# EAGLE board BBB_POPS_Cape (EAGLE 6.5.0), part 1 of 2
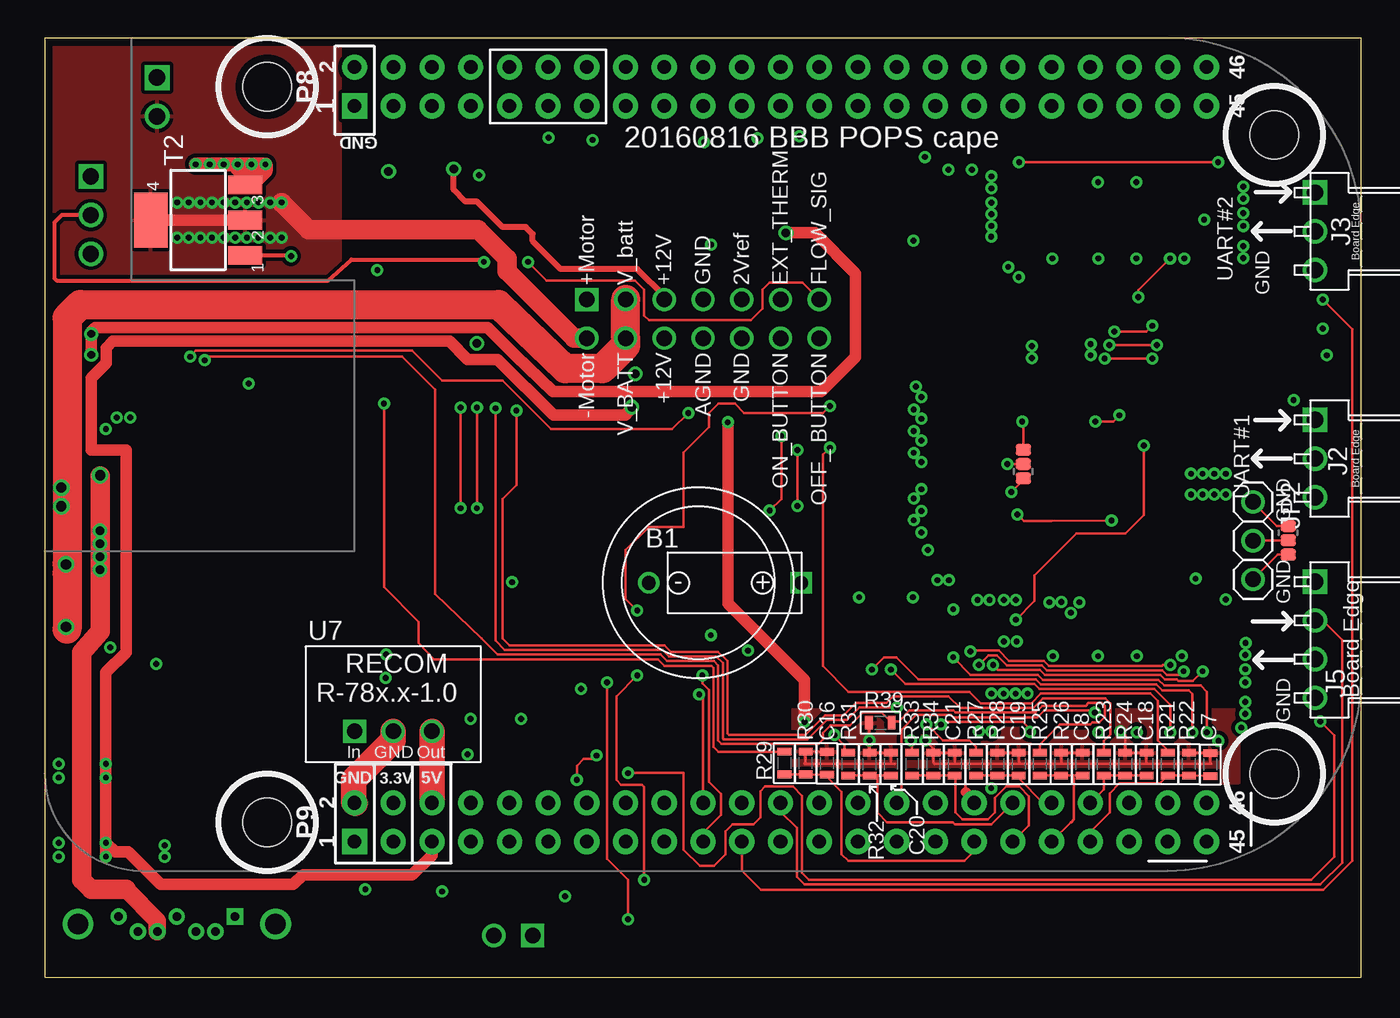
[diagram p5: board, top side]
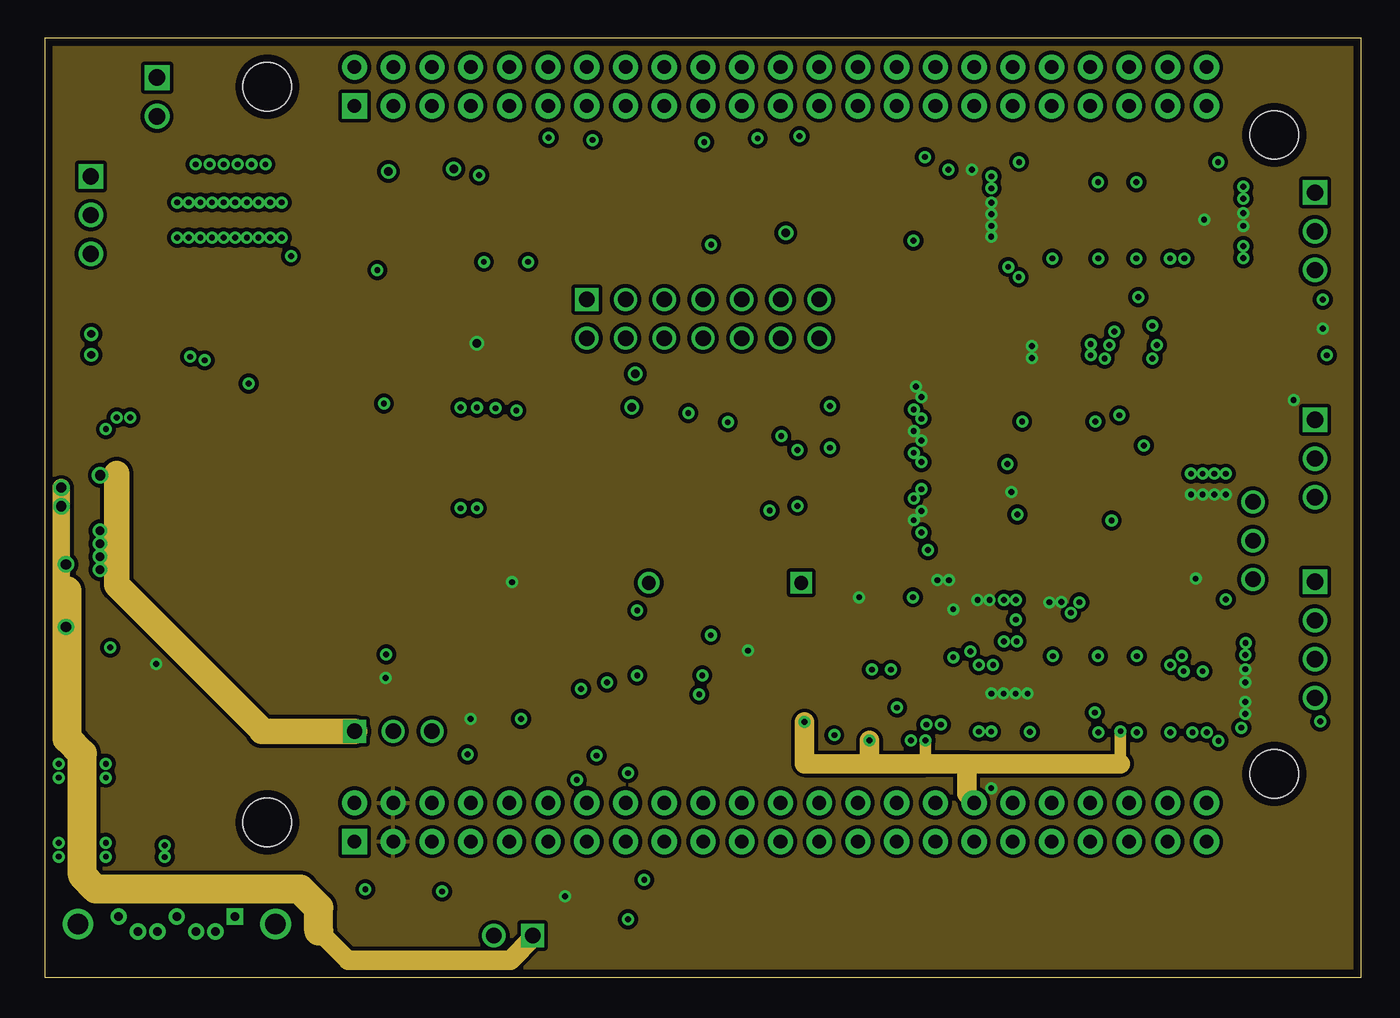
[diagram p6: board, inner layer Route2]
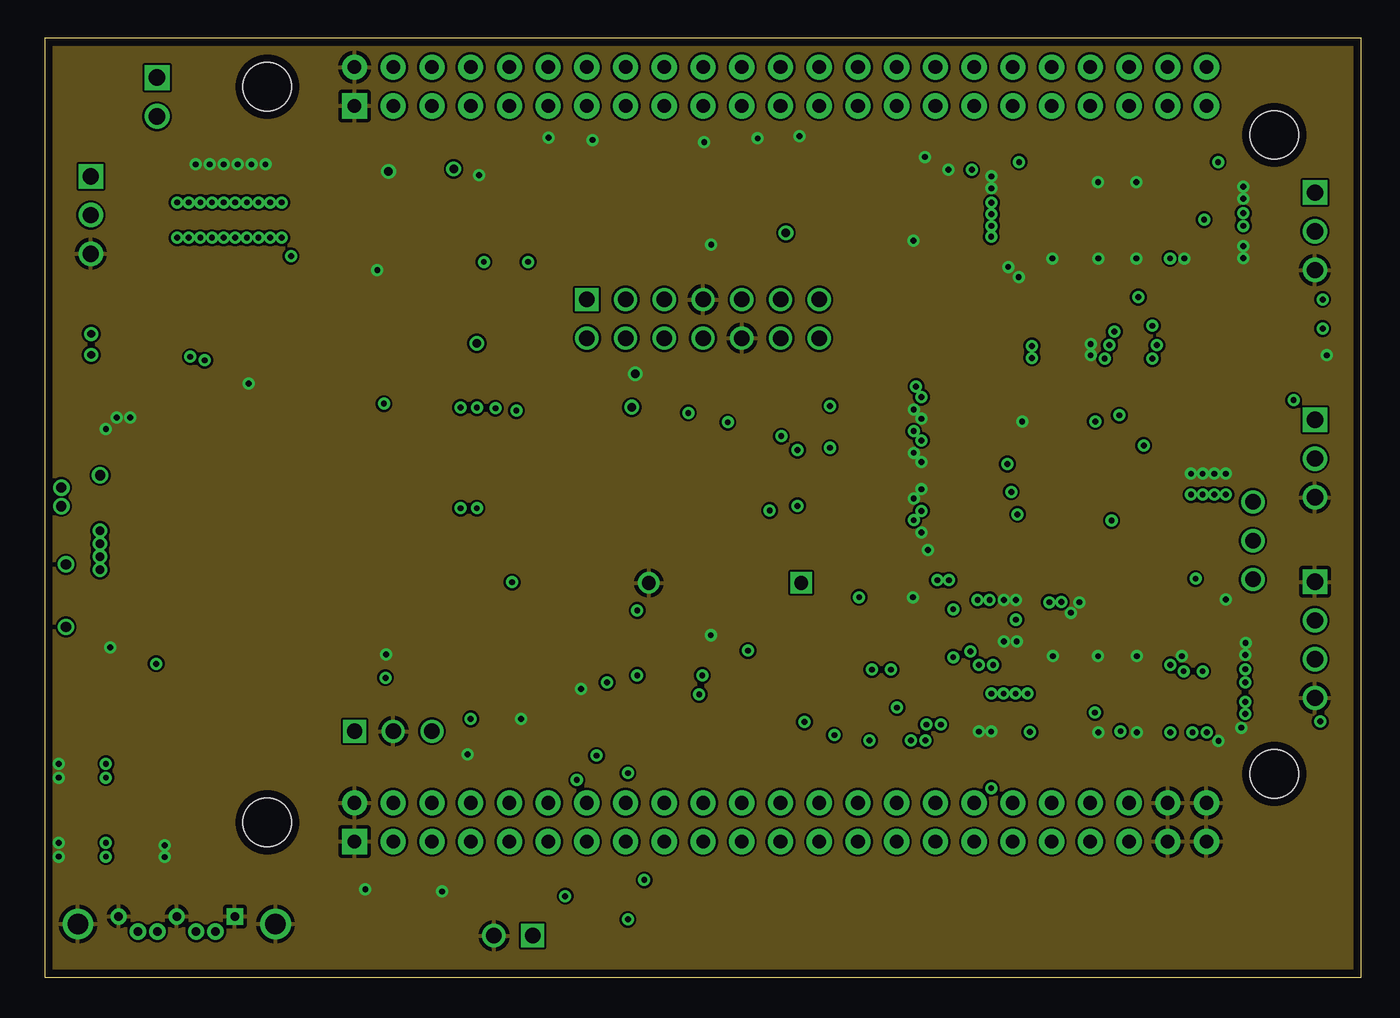
[diagram p7: board, inner layer Route15]
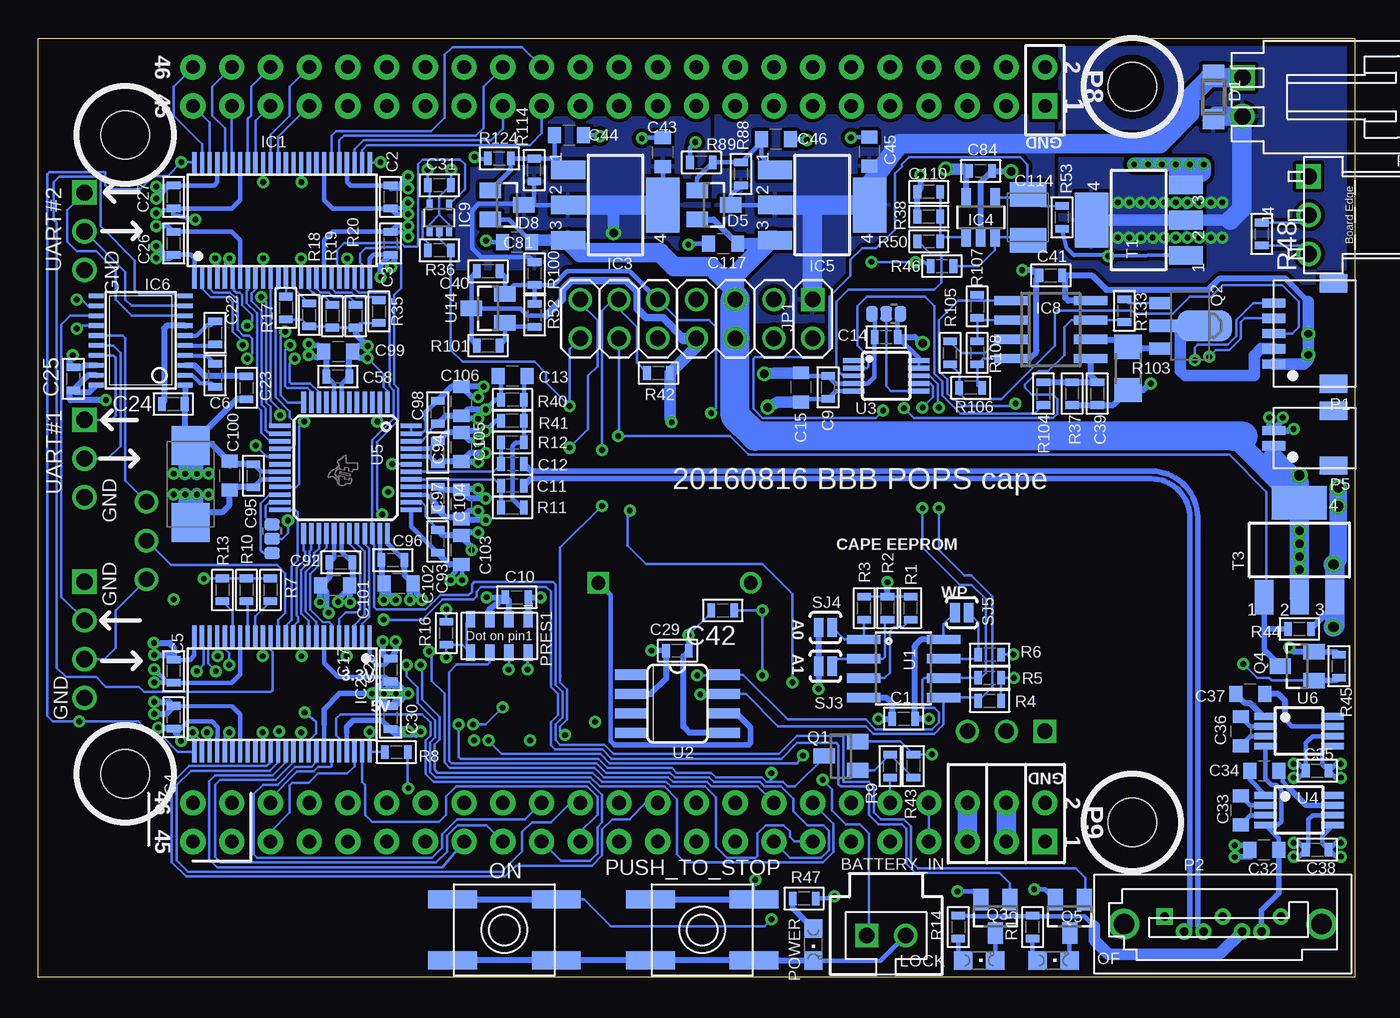
[diagram p8: board, bottom side, seen from below]

Size 86.36 x 61.62 mm. Coordinates in mm from the lower left corner, seen from the top.
Outline: 0,0 86.36,0 86.36,61.62 0,61.62 0,0
Copper layers (1*2+15*16): Top 0.035mm / dielectric 1.5mm / Route2 0.035mm / dielectric 0.15mm / Route15 0.035mm / dielectric 0.2mm / Bottom 0.035mm
Design rules "66each *": minimum track width 6mil, minimum drill 15mil, track to track 6mil, track to pad 6mil, pad to pad 6mil, via to via 6mil, smd to smd 6mil, copper to edge 20mil, drill to drill 10mil, minimum pad ring 10mil, minimum via ring 8mil, stop-mask expansion 4mil, vias tented up to drill 16mil, thermal gap 10mil
Net classes: 0 default: width 0.152 mm, drill 0.381 mm, clearance 0.152 mm; 2 gnd: width 0.152 mm, drill 0.381 mm, clearance 0.152 mm; 3 usbvcc: width 0.152 mm, drill 0.381 mm, clearance 0.152 mm

## Footprints (pad centres in the part's own frame; a part is rotated, then mirrored left to right if it is on the bottom)
BR1225A/HB = drill 0.9 square: P$1 6.75,0 | drill 0.9: P$2 -3.25,0
070543-0036 = drill 1.016 square: P$1 -1.27,0 | drill 1.016: P$2 1.27,0
0603 = smd 0.5 x 0.9: 1 -0.75,0; 2 0.75,0
0805_MARISS = smd 0.846 x 1.059: 1 -0.953,0; 2 0.953,0
C/6032-28R = smd 2.55 x 2.5: + 2.525,0; - -2.525,0
SMC_B = smd 1.6 x 2.4: + -1.5,0; - 1.5,0
DO-219ABVISHAY = smd 1.3 x 1.4: A 1.45,0; C -1.45,0
SOT23 = smd 1 x 1.4: 1 -0.95,-1.1; 2 0.95,-1.1; 3 0,1.1
TSSOP-48 = smd 0.28 x 1.43: 1 -5.49,-3.794; 2 -4.99,-3.794; 3 -4.49,-3.794; 4 -3.99,-3.794; 5 -3.49,-3.794; 6 -2.99,-3.794; 7 -2.49,-3.794; 8 -1.99,-3.794; 9 -1.49,-3.794; 10 -0.99,-3.794; 11 -0.49,-3.794; 12 0.01,-3.794; 13 0.51,-3.794; 14 1.01,-3.794; 15 1.51,-3.794; 16 2.01,-3.794; 17 2.51,-3.794; 18 3.01,-3.794; 19 3.51,-3.794; 20 4.01,-3.794; 21 4.51,-3.794; 22 5.01,-3.794; 23 5.51,-3.794; 24 6.01,-3.794; 25 6.01,3.756; 26 5.51,3.756; 27 5.01,3.756; 28 4.51,3.756; 29 4.01,3.756; 30 3.51,3.756; 31 3.01,3.756; 32 2.51,3.756; 33 2.01,3.756; 34 1.51,3.756; 35 1.01,3.756; 36 0.51,3.756; 37 0.01,3.756; 38 -0.49,3.756; 39 -0.99,3.756; 40 -1.49,3.756; 41 -1.99,3.756; 42 -2.49,3.756; 43 -2.99,3.756; 44 -3.49,3.756; 45 -3.99,3.756; 46 -4.49,3.756; 47 -4.99,3.756; 48 -5.49,3.756
S0T-223 = smd 1.219 x 2.235: 1 -2.311,-3.099; 2 0,-3.099; 3 2.311,-3.099 | smd 3.6 x 2.2: 4 0,3.099
SOT23-5 = smd 0.6 x 1.2: 1 -0.95,-1.306; 2 0,-1.306; 3 0.95,-1.306; 4 0.95,1.306; 5 -0.95,1.306
TSSOP20 = smd 0.305 x 0.991: 1 -2.925,-2.918; 2 -2.275,-2.918; 3 -1.625,-2.918; 4 -0.975,-2.918; 5 -0.325,-2.918; 6 0.325,-2.918; 7 0.975,-2.918; 8 1.625,-2.918; 9 2.275,-2.918; 10 2.925,-2.918; 11 2.925,2.918; 12 2.275,2.918; 13 1.625,2.918; 14 0.975,2.918; 15 0.325,2.918; 16 -0.325,2.918; 17 -0.975,2.918; 18 -1.625,2.918; 19 -2.275,2.918; 20 -2.925,2.918
SO8 = smd 0.6 x 2.2: 1 -1.905,-2.6; 2 -0.635,-2.6; 3 0.635,-2.6; 4 1.905,-2.6; 5 1.905,2.6; 6 0.635,2.6; 7 -0.635,2.6; 8 -1.905,2.6
SC70-5 = smd 0.4 x 0.7: 1 -0.65,-0.85; 2 0,-0.85; 3 0.65,-0.85; 4 0.65,0.85; 5 -0.65,0.85
640457-3 = drill 1.067 square: 1 2.54,0 | drill 1.067: 2 0,0; 3 -2.54,0
640457-4 = drill 1.067 square: 1 3.81,0 | drill 1.067: 2 1.27,0; 3 -1.27,0; 4 -3.81,0
MY_C0R-JMP = smd 0.991 x 0.762: 1 0,0.938; 2 0,0; 3 0,-0.938
2X07_ROUND = drill 1.016 square: 1 -7.62,-1.27 | drill 1.016: 2 -7.62,1.27; 3 -5.08,-1.27; 4 -5.08,1.27; 5 -2.54,-1.27; 6 -2.54,1.27; 7 0,-1.27; 8 0,1.27; 9 2.54,-1.27; 10 2.54,1.27; 11 5.08,-1.27; 12 5.08,1.27; 13 7.62,-1.27; 14 7.62,1.27
1X03_ROUND = drill 1.016: 1 -2.54,0; 2 0,0; 3 2.54,0
LED-805 = smd 1.2 x 1.2: A 0,-1.05; C 0,1.05
EVQ-Q2 = smd 3.2 x 1.2: A -3.4,-2; A' 3.4,-2; B -3.4,2; B' 3.4,2
501568-0509 = smd 0.6 x 1.5: 1 -2,2.54; 2 -1,2.54; 3 0,2.54; 4 1,2.54; 5 2,2.54 | smd 1.2 x 1.8: P$1 3.3,-1.36; P$2 -3.3,-1.36
0471554001 = drill 0.559 pad 1.067 square: 1 3.81,-0.5 | drill 0.559 pad 1.067: 2 2.54,0.5; 3 1.27,0.5; 4 0,-0.5; 5 -1.27,0.5; 6 -2.54,0.5; 7 -3.81,-0.5 | drill 1.35: MH1 -6.48,0; MH2 6.48,0
501568-0207_2-PIN = smd 0.6 x 1.5: 1 -0.5,2.54; 2 0.5,2.54 | smd 1.2 x 1.8: P$1 1.8,-1.36; P$2 -1.8,-1.36
0705530001_2-PIN_H_CGRID_SL = drill 1.092 square: P$1 1.27,0 | drill 1.092: P$2 -1.27,0
MS5607-02BA = smd 1.1 x 0.6: 1 -1.1,1.875; 2 -1.1,0.625; 3 -1.1,-0.625; 4 -1.1,-1.875; 5 1.1,-1.875; 6 1.1,-0.625; 7 1.1,0.625; 8 1.1,1.875
SOT89 = smd 0.8 x 1.4: 1 -1.499,-1.981; 3 1.499,-1.981 | smd 0.8 x 1.9: 2 0,-1.727 | smd 2.032 x 3.65: 2@1 0,0.94
SOT-23 = smd 1 x 1.4: 1 -0.95,-1.1; 2 0.95,-1.1; 3 0,1.1
R1206 = smd 1.6 x 1.803: 1 -1.422,0; 2 1.422,0
SJ_2S-NO = smd 0.635 x 1.27: 1 -0.45,0; 2 0.45,0
SOT223 = smd 1.219 x 2.235: 1 -2.311,-3.099; 2 0,-3.099; 3 2.311,-3.099 | smd 3.6 x 2.2: 4 0,3.099
SO08 = smd 0.61 x 2.21: 1 -1.905,-2.616; 2 -0.635,-2.616; 3 0.635,-2.616; 4 1.905,-2.616; 5 1.905,2.616; 6 0.635,2.616; 7 -0.635,2.616; 8 -1.905,2.616
SO08' = smd 0.66 x 2.032: 1 -1.905,-3.073; 2 -0.635,-3.073; 3 0.635,-3.073; 4 1.905,-3.073; 5 1.905,3.073; 6 0.635,3.073; 7 -0.635,3.073; 8 -1.905,3.073
MY_UMAX10 = smd 0.32 x 1.4: 1 -1,-2.14; 2 -0.5,-2.14; 3 0,-2.14; 4 0.5,-2.14; 5 1,-2.14; 6 1,2.14; 7 0.5,2.14; 8 0,2.14; 9 -0.5,2.14; 10 -1,2.14
MY_DGK_S-PDSO-G8 = smd 0.45 x 1.45: 1 -0.975,-2.2; 2 -0.325,-2.2; 3 0.325,-2.2; 4 0.975,-2.2; 5 0.975,2.2; 6 0.325,2.2; 7 -0.325,2.2; 8 -0.975,2.2
PFB_S-PQFP-G48 = smd 1.4 x 0.3: 1 -4.3,2.75; 2 -4.3,2.25; 3 -4.3,1.75; 4 -4.3,1.25; 5 -4.3,0.75; 6 -4.3,0.25; 7 -4.3,-0.25; 8 -4.3,-0.75; 9 -4.3,-1.25; 10 -4.3,-1.75; 11 -4.3,-2.25; 12 -4.3,-2.75; 25 4.3,-2.75; 26 4.3,-2.25; 27 4.3,-1.75; 28 4.3,-1.25; 29 4.3,-0.75; 30 4.3,-0.25; 31 4.3,0.25; 32 4.3,0.75; 33 4.3,1.25; 34 4.3,1.75; 35 4.3,2.25; 36 4.3,2.75 | smd 0.3 x 1.4: 13 -2.75,-4.3; 14 -2.25,-4.3; 15 -1.75,-4.3; 16 -1.25,-4.3; 17 -0.75,-4.3; 18 -0.25,-4.3; 19 0.25,-4.3; 20 0.75,-4.3; 21 1.25,-4.3; 22 1.75,-4.3; 23 2.25,-4.3; 24 2.75,-4.3; 37 2.75,4.3; 38 2.25,4.3; 39 1.75,4.3; 40 1.25,4.3; 41 0.75,4.3; 42 0.25,4.3; 43 -0.25,4.3; 44 -0.75,4.3; 45 -1.25,4.3; 46 -1.75,4.3; 47 -2.25,4.3; 48 -2.75,4.3
RECOM_R-78X-1.0 = drill 1: GND 0,0; VOUT 2.54,0 | drill 1 square: VIN -2.54,0
MY_BBB_CAPE = drill 0.889 pad 1.651 square: P8.1 20.32,50.165; P9.1 20.32,1.905 | drill 0.889 pad 1.651: P8.2 20.32,52.705; P8.3 22.86,50.165; P8.4 22.86,52.705; P8.5 25.4,50.165; P8.6 25.4,52.705; P8.7 27.94,50.165; P8.8 27.94,52.705; P8.9 30.48,50.165; P8.10 30.48,52.705; P8.11 33.02,50.165; P8.12 33.02,52.705; P8.13 35.56,50.165; P8.14 35.56,52.705; P8.15 38.1,50.165; P8.16 38.1,52.705; P8.17 40.64,50.165; P8.18 40.64,52.705; P8.19 43.18,50.165; P8.20 43.18,52.705; P8.21 45.72,50.165; P8.22 45.72,52.705; P8.23 48.26,50.165; P8.24 48.26,52.705; P8.25 50.8,50.165; P8.26 50.8,52.705; P8.27 53.34,50.165; P8.28 53.34,52.705; P8.29 55.88,50.165; P8.30 55.88,52.705; P8.31 58.42,50.165; P8.32 58.42,52.705; P8.33 60.96,50.165; P8.34 60.96,52.705; P8.35 63.5,50.165; P8.36 63.5,52.705; P8.37 66.04,50.165; P8.38 66.04,52.705; P8.39 68.58,50.165; P8.40 68.58,52.705; P8.41 71.12,50.165; P8.42 71.12,52.705; P8.43 73.66,50.165; P8.44 73.66,52.705; P8.45 76.2,50.165; P8.46 76.2,52.705; P9.2 20.32,4.445; P9.3 22.86,1.905; P9.4 22.86,4.445; P9.5 25.4,1.905; P9.6 25.4,4.445; P9.7 27.94,1.905; P9.8 27.94,4.445; P9.9 30.48,1.905; P9.10 30.48,4.445; P9.11 33.02,1.905; P9.12 33.02,4.445; P9.13 35.56,1.905; P9.14 35.56,4.445; P9.15 38.1,1.905; P9.16 38.1,4.445; P9.17 40.64,1.905; P9.18 40.64,4.445; P9.19 43.18,1.905; P9.20 43.18,4.445; P9.21 45.72,1.905; P9.22 45.72,4.445; P9.23 48.26,1.905; P9.24 48.26,4.445; P9.25 50.8,1.905; P9.26 50.8,4.445; P9.27 53.34,1.905; P9.28 53.34,4.445; P9.29 55.88,1.905; P9.30 55.88,4.445; P9.31 58.42,1.905; P9.32 58.42,4.445; P9.33 60.96,1.905; P9.34 60.96,4.445; P9.35 63.5,1.905; P9.36 63.5,4.445; P9.37 66.04,1.905; P9.38 66.04,4.445; P9.39 68.58,1.905; P9.40 68.58,4.445; P9.41 71.12,1.905; P9.42 71.12,4.445; P9.43 73.66,1.905; P9.44 73.66,4.445; P9.45 76.2,1.905; P9.46 76.2,4.445 | hole 3.175: 14.605,3.175; 80.645,6.35; 80.645,48.26; 14.605,51.435

## Placement (x,y rotation side)
B1  BR1225HB  [BR1225A/HB]  42.88,25.88 0 top
BATTERY_IN  Do Not Populate!  [070543-0036]  30.73,2.74 0 bottom
C1  0.1uF  [0603]  29.59,16.97 0 bottom
C2  0.1uF  [0603]  63.25,51.21 90 bottom
C3  0.1uF  [0603]  63.25,48.16 270 bottom
C4  0.1uF  [0603]  77.47,17.07 270 bottom
C5  0.1uF  [0603]  77.47,20.09 90 bottom
C6  0.1uF  [0603]  74.75,39.5 270 bottom
C7  0.1uF  [0603]  76.45,13.97 90 top
C8  0.1uF  [0603]  68.07,14 90 top
C9  0.1uF  [0603]  34.54,38.71 90 bottom
C10  0.1uF  [0603]  54.97,24.94 180 bottom
C11  0.1uF  [0603]  55.24,32.26 180 bottom
C12  0.1uF  [0603]  55.24,33.68 0 bottom
C13  4.7nF  [0805_MARISS]  55.24,39.45 180 bottom
C14  0.1uF  [0603]  30.73,42.01 180 bottom
C15  4.7uF  [0805_MARISS]  36.32,38.71 90 bottom
C16  0.1uF  [0603]  51.31,14.05 90 top
C17  100uF  [C/6032-28R]  76.35,32.36 270 bottom
C18  0.1uF  [0603]  72.26,14 90 top
C19  0.1uF  [0603]  63.88,14 90 top
C20  0.1uF  [0603]  55.5,14 90 top
C21  0.1uF  [0603]  59.69,14 90 top
C22  0.1uF  [0603]  74.75,42.29 270 bottom
C23  0.1uF  [0603]  72.69,38.68 270 bottom
C24  0.1uF  [0603]  77.5,37.62 0 bottom
C25  0.1uF  [0603]  84.05,39.27 90 bottom
C26  0.1uF  [0603]  77.47,48.16 270 bottom
C27  0.1uF  [0603]  77.47,51.21 90 bottom
C28  0.1uF  [0603]  63.25,20.17 90 bottom
C29  0.1uF  [0603]  44.42,21.44 0 bottom
C30  0.1uF  [0603]  63.25,17.04 270 bottom
C31  0.1uF  [0603]  60.05,51.97 0 bottom
C32  3.3uF  [0805_MARISS]  5.94,8.38 180 bottom
C33  3.3uF  [0805_MARISS]  7.47,10.97 270 bottom
C34  3.3uF  [0805_MARISS]  5.94,13.56 0 bottom
C35  0.1uF  [0603]  2.46,13.56 0 bottom
C36  3.3uF  [0805_MARISS]  7.47,16.15 270 bottom
C37  3.3uF  [0805_MARISS]  6.86,18.59 0 bottom
C38  0.1uF  [0603]  2.46,8.38 0 bottom
C39  0.1uF  [0603]  16.89,38.3 270 bottom
C40  0.1uF  [0603]  56.85,46.33 180 bottom
C41  0.1uF  [0603]  19.94,46.05 180 bottom
C42  0.1uF  [0603]  41.45,24.08 180 bottom
C43  4.7uF  [0805_MARISS]  45.39,54.13 90 bottom
C44  4.7uF  [0805_MARISS]  51.54,55.24 0 bottom
C45  4.7uF  [0805_MARISS]  31.83,54.18 90 bottom
C46  4.7uF  [0805_MARISS]  37.97,54.99 0 bottom
C58  0.01uF  [0603]  66.7,39.42 180 bottom
C81  10uF  [0805_MARISS]  54.94,48.23 180 bottom
C84  0.1uF  [0603]  24.54,52.91 0 bottom
C92  0.01uF  [0603]  66.5,27.23 180 bottom
C93  0.01uF  [0603]  60.15,28.6 90 bottom
C94  0.01uF  [0603]  60.15,34.42 270 bottom
C95  0.1uF  [0603]  72.24,32.92 90 bottom
C96  0.1uF  [0603]  63.09,27.38 180 bottom
C97  0.1uF  [0603]  60.15,31.45 90 bottom
C98  0.1uF  [0603]  60.15,37.08 270 bottom
C99  4.7uF  [0805_MARISS]  66.67,41.05 180 bottom
C100  4.7uF  [0805_MARISS]  73.79,32.92 90 bottom
C101  4.7uF  [0805_MARISS]  66.88,25.7 180 bottom
C102  4.7uF  [0805_MARISS]  62.71,25.86 180 bottom
C103  4.7uF  [0805_MARISS]  58.6,28.04 90 bottom
C104  4.7uF  [0805_MARISS]  58.6,31.04 90 bottom
C105  4.7uF  [0805_MARISS]  58.6,34.8 270 bottom
C106  4.7uF  [0805_MARISS]  58.6,37.8 270 bottom
C110  0.1uF  [0603]  27.94,51.54 180 bottom
C114  22uF  [SMC_B]  21.44,49.86 270 bottom
C117  10uF  [0805_MARISS]  41.43,48.13 180 bottom
D1  VS-2EFH02-M3/IGICT-ND  [DO-219ABVISHAY]  9.27,57.76 270 bottom
D5  BAV199  [SOT23]  42.04,50.67 270 bottom
D8  BAV199  [SOT23]  55.6,50.67 270 bottom
IC1  SN74LVCH16245ADGGR  [TSSOP-48]  70.61,49.68 0 bottom
IC2  SN74LVCH16245ADGGR  [TSSOP-48]  70.1,18.57 180 bottom
IC3  LM317SOT-223  [S0T-223]  48.49,50.67 270 bottom
IC4  LM321MFX/NOPBCT-ND  [SOT23-5]  24.54,49.86 0 bottom
IC5  LM317SOT-223  [S0T-223]  34.92,50.67 270 bottom
IC6  MAX3223EIPWR  [TSSOP20]  79.63,41.78 90 bottom
IC8  AD8032ARZ  [SO8]  19.94,42.49 270 bottom
IC9  74AHC1G86DCK  [SC70-5]  60.05,49.83 0 bottom
J2  UART_1  [640457-3]  83.31,34.04 90 top
J3  UART_2  [640457-3]  83.31,48.95 90 top
J4  Do Not Populate!  [640457-3]  3.02,50.01 90 bottom
J5  AMP100640456-4RA  [640457-4]  83.31,22.15 90 top
JMP1  0R-JUMPMINE  [MY_C0R-JMP]  64.19,33.68 180 top
JMP2  0R-JUMPMINE  [MY_C0R-JMP]  81.56,28.68 0 top
JMP7  0R-JUMPMINE  [MY_C0R-JMP]  30.73,43.54 270 bottom
JMP10  0R-JUMPMINE  [MY_C0R-JMP]  71.02,28.78 0 bottom
JP1  SSQ-107-02-T-D  [2X07_ROUND]  43.18,43.21 180 bottom
JP2  Do Not Populate!  [1X03_ROUND]  79.25,28.65 270 top
LOCK  Green  [LED-805]  24.64,1.12 270 bottom
OF  Red  [LED-805]  19.76,1.12 270 bottom
ON  EVQ-Q2B03W  [EVQ-Q2]  55.78,3.12 180 bottom
P1  Laser  [501568-0509]  2.77,42.24 90 bottom
P2  0471554001 SATA Vert  [0471554001]  8.66,3.51 180 bottom
P5  Laser Heater  [501568-0207_2-PIN]  2.77,35.38 90 bottom
P6  Do Not Populate!  [0705530001_2-PIN_H_CGRID_SL]  7.37,57.76 90 bottom
POWER  Blue  [LED-805]  35.51,2.16 180 bottom
PRES1  MS5607-02BA03  [MS5607-02BA]  56.11,22.4 270 bottom
PUSH_TO_STOP  EVQ-Q2B03W  [EVQ-Q2]  42.8,3.12 180 bottom
Q1  N-Chan  [SOT23]  33.71,14.53 90 bottom
Q2  NPNSOT89  [SOT89]  10.79,42.75 270 bottom
Q3  N-Chan  [SOT-23]  23.57,4.01 180 bottom
Q4  N-Chan  [SOT-23]  3.78,20.42 90 bottom
Q5  N-Chan  [SOT-23]  18.69,4.01 180 bottom
R1  4.7K  [0603]  29.13,24.23 270 bottom
R2  4.7K  [0603]  30.66,24.23 270 bottom
R3  4.7K  [0603]  32.18,24.23 270 bottom
R4  4.7K  [0603]  23.95,18.14 180 bottom
R5  4.7K  [0603]  23.95,19.66 180 bottom
R6  4.7K  [0603]  23.95,21.18 0 bottom
R7  10K  [0603]  71.12,25.43 270 bottom
R8  10K  [0603]  62.87,14.78 0 bottom
R9  1K  [0603]  30.48,13.87 270 bottom
R10  10K  [0603]  72.69,25.43 270 bottom
R11  50 Ohm  [0603]  55.24,30.84 180 bottom
R12  50 Ohm  [0603]  55.24,35.1 180 bottom
R13  10K  [0603]  74.27,25.43 270 bottom
R14  4.7K  [0603]  26.01,3.3 90 bottom
R15  4.7K  [0603]  21.13,3.3 90 bottom
R16  10K  [0603]  59.59,22.58 90 bottom
R17  10K  [0603]  70.1,43.92 90 bottom
R18  10K  [0603]  68.58,43.46 90 bottom
R19  10K  [0603]  67.06,43.38 90 bottom
R20  10K  [0603]  65.53,43.38 90 bottom
R21  8.45K  [0603]  73.66,14 90 top
R22  4.7K  [0603]  75.06,14 90 top
R23  18.7K  [0603]  69.47,14 270 top
R24  2.55K  [0603]  70.87,14 90 top
R25  Short  [0603]  65.28,14 90 top
R26  Open  [0603]  66.67,14 90 top
R27  8.45K  [0603]  61.09,14 270 top
R28  4.7K  [0603]  62.48,14 90 top
R29  8.45K  [0603]  48.51,14.07 90 top
R30  4.7K  [0603]  49.91,14.07 90 top
R31  Short  [0603]  52.7,14 90 top
R32  Open  [0603]  54.1,14 270 top
R33  11.5K  [0603]  56.9,14 90 top
R34  1.13K  [0603]  58.29,14 90 top
R35  10K  [0603]  64.01,43.69 90 bottom
R36  10K  [0603]  60.05,47.7 0 bottom
R37  6.04K  [0603]  18.54,38.3 270 bottom
R38  Open  [0603]  27.94,49.91 180 bottom
R39  1.24K  [0603]  54.81,16.71 0 top
R40  750 Ohm  [0603]  55.24,37.9 0 bottom
R41  1.3K  [0603]  55.24,36.53 180 bottom
R42  1.24K  [0603]  45.67,39.65 180 bottom
R43  10K  [0603]  28.96,13.87 90 bottom
R44  4.7K  [0603]  3.63,22.86 180 bottom
R45  4.7K  [0603]  1.04,20.42 270 bottom
R46  499K  [0603]  27.08,46.66 180 bottom
R47  1K  [0603]  36.12,5.18 0 bottom
R48  499K  [0603]  6.1,48.77 270 bottom
R50  1K  [0603]  27.94,48.29 180 bottom
R52  20K  [0603]  53.8,43.43 270 bottom
R53  1K  [0603]  19.2,49.86 90 bottom
R88  240 Ohm  [0603]  40.26,52.7 90 bottom
R89  1.24K  [0603]  42.85,53.47 180 bottom
R100  1K  [0603]  53.8,46.18 270 bottom
R101  10.5K  [0603]  56.85,41.45 180 bottom
R103  10 Ohms  [R1206]  14.86,39.95 90 bottom
R104  18.7K  [0603]  20.42,38.3 270 bottom
R105  1K  [0603]  26.54,40.97 270 bottom
R106  1K  [0603]  25.2,38.68 180 bottom
R107  1K  [0603]  24.77,44.02 90 bottom
R108  1K  [0603]  24.77,40.97 90 bottom
R114  240 Ohm  [0603]  53.82,52.96 90 bottom
R124  1.24K  [0603]  56.11,53.72 180 bottom
R133  1K  [0603]  15.11,43.74 270 bottom
SJ3  A1  [SJ_2S-NO]  34.72,20.42 0 bottom
SJ4  A0  [SJ_2S-NO]  34.72,22.96 0 bottom
SJ5  WP  [SJ_2S-NO]  25.78,23.93 180 bottom
T1  FDT1600N10ALC N-Chan  [SOT223]  14.17,49.68 90 bottom
T2  Do Not Populate!  [SOT223]  10.06,49.68 90 top
T3  DMP6023LE-13 P-Chan  [SOT223]  3.63,28.04 0 bottom
U1  M24256-BRMN6TP  [SO08]  29.59,20.27 270 bottom
U2  DS3231MZ/V  [SO08']  44.42,17.96 270 bottom
U3  MAX5802AAUB  [MY_UMAX10]  30.73,39.47 270 bottom
U4  LM2682MM  [MY_DGK_S-PDSO-G8]  3.66,10.97 270 bottom
U5  DS90C124  [PFB_S-PQFP-G48]  66.19,33.43 270 bottom
U6  Do Not Populate!  [MY_DGK_S-PDSO-G8]  3.66,16.15 270 bottom
U7  R-785.0-1.0 Vert  [RECOM_R-78X-1.0]  22.86,16.15 0 top
U14  TLVH431BQDBZR  [SOT23]  56.85,43.89 90 bottom
U$2  BEAGLE_BONE_BLACK_CAPEME  [MY_BBB_CAPE]  0,7.01 0 top